# EasyEDA Pro project SSRC v2.eprj

# Schematic Schematic1
Board Name: PCB2; Create Date: 2025-12-02; Page Name: P1; Project Name: SSRC v2; Schematic Name: Schematic1; Update Date: 2025-12-25; Company: EasyEDA.com; Page Size: A4; Version: V1.0
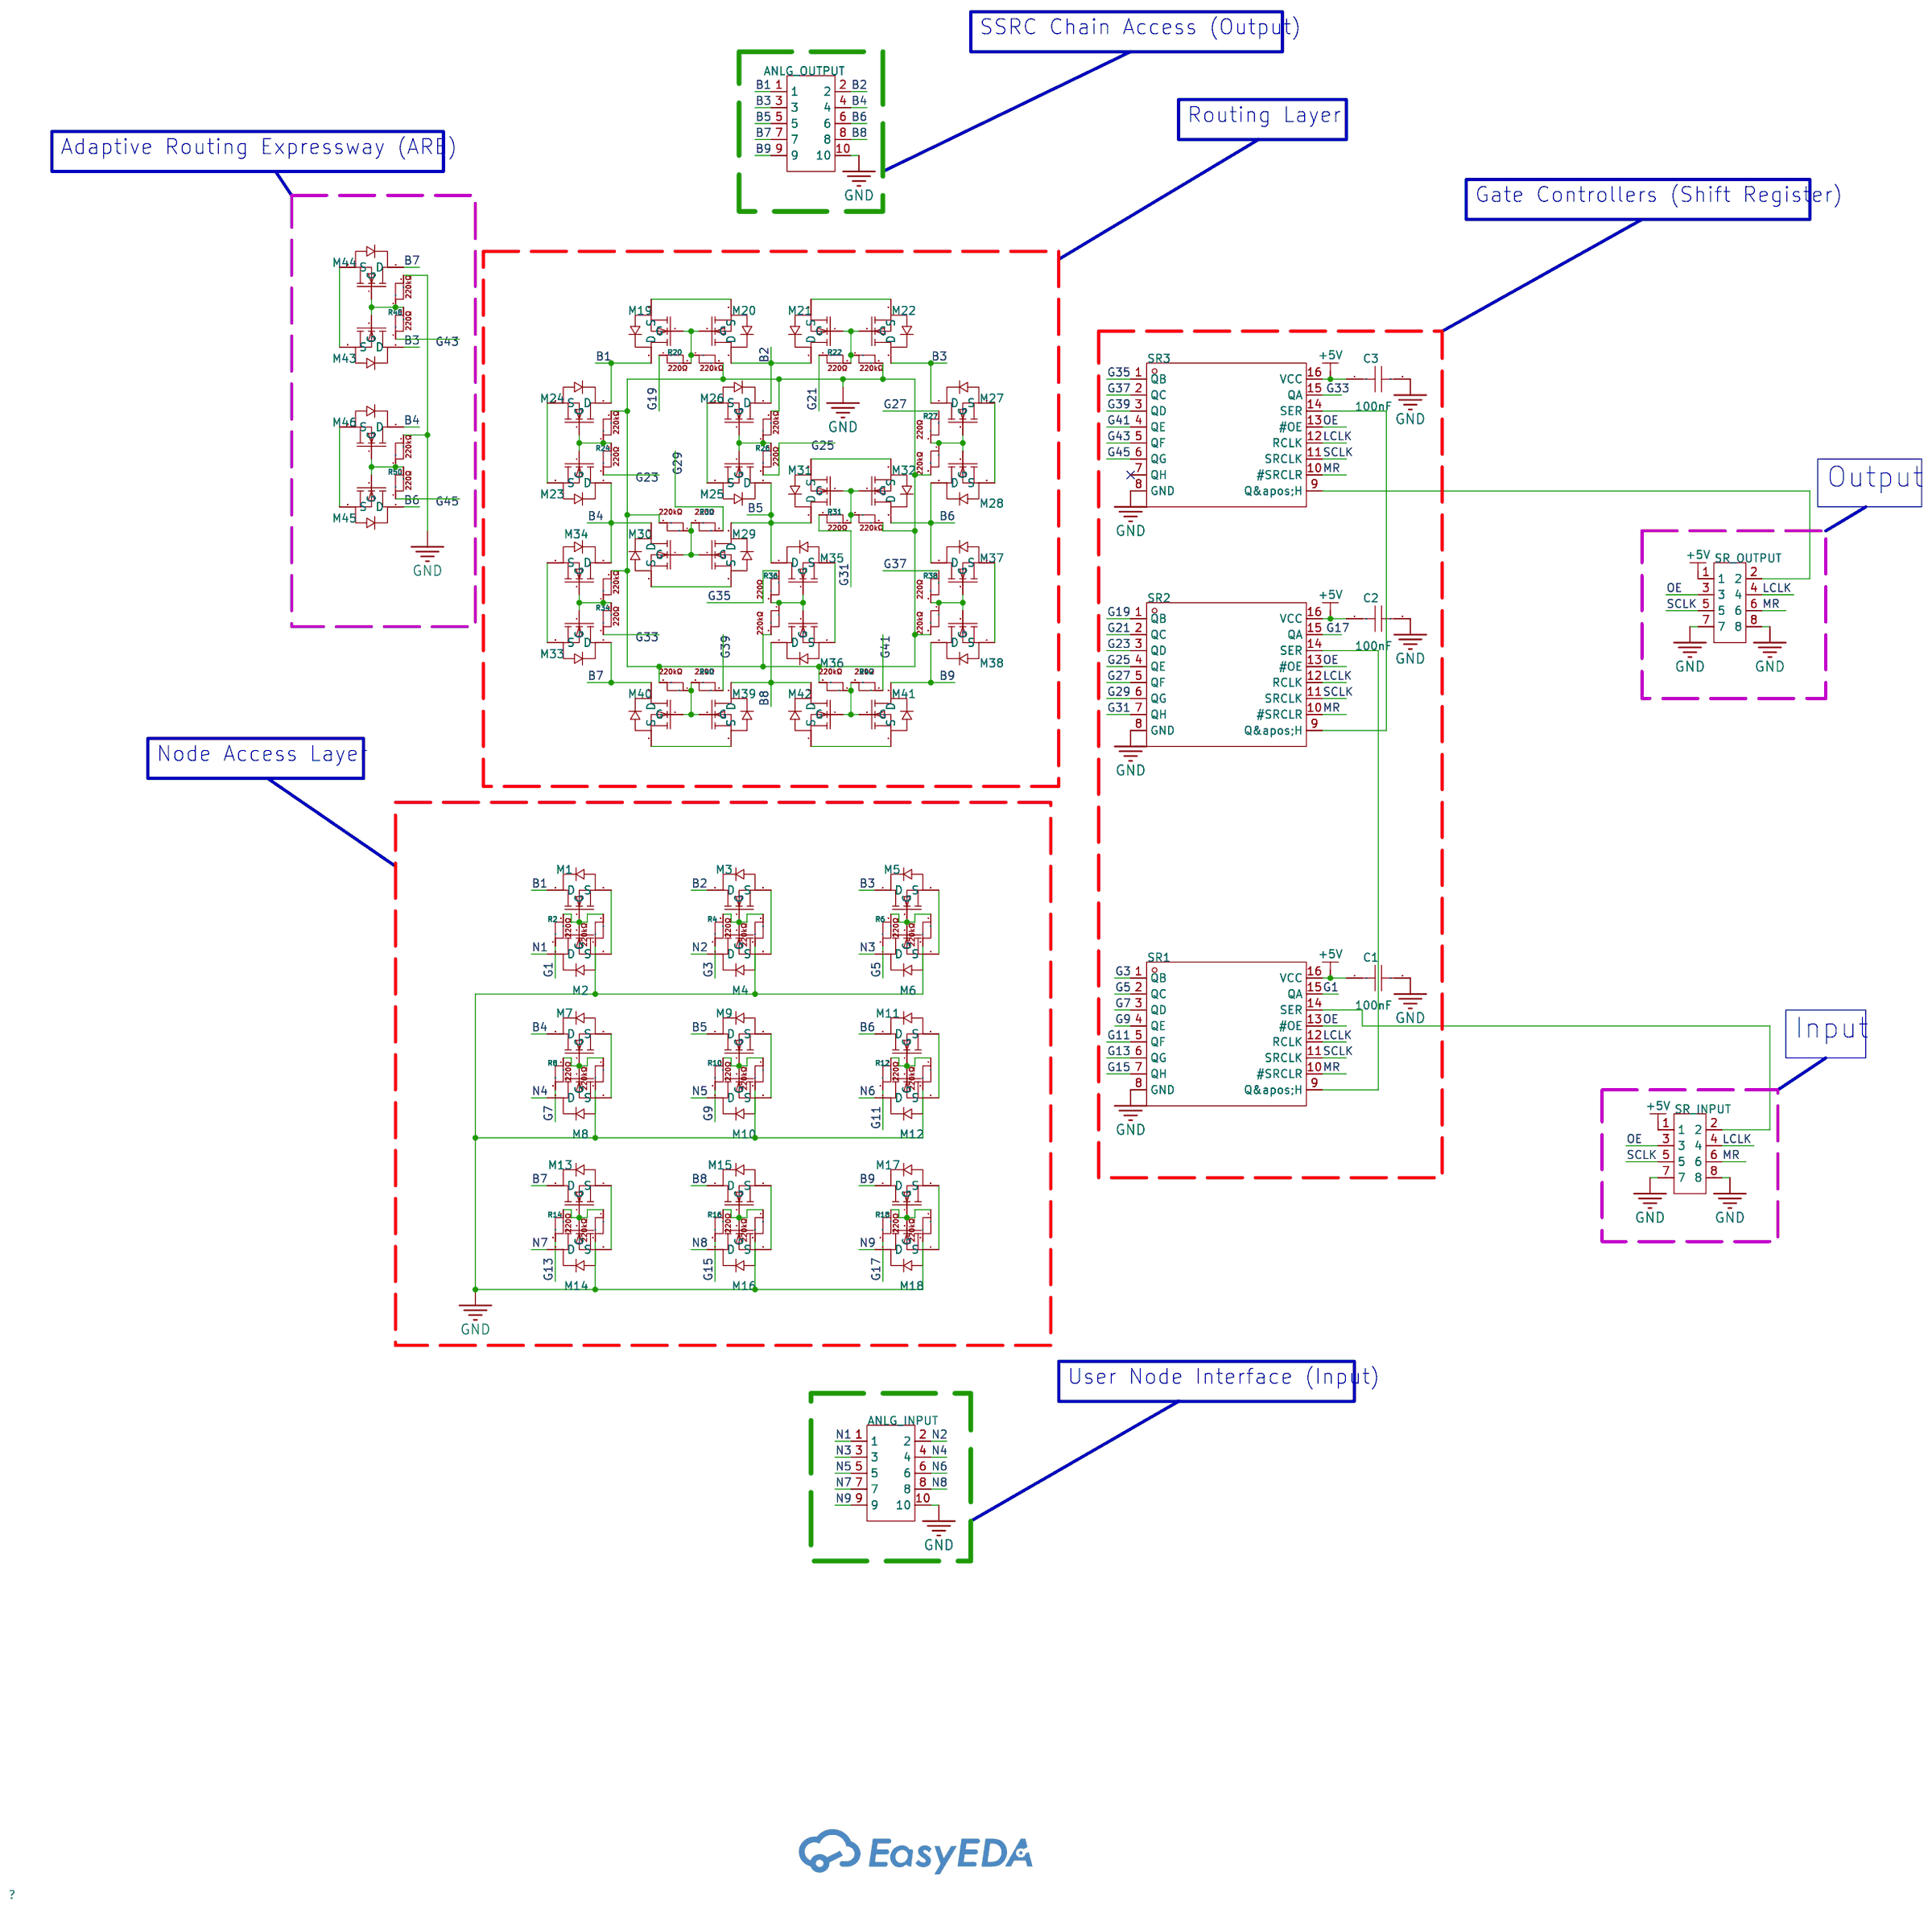
[diagram p0: schematic sheet]

## Parts
ANLG_INPUT  PZ254V-12-10P  [HDR-TH_10P-P2.54-V-M-R2-C5-S2.54]
ANLG_OUTPUT  PZ254V-12-10P  [HDR-TH_10P-P2.54-V-M-R2-C5-S2.54]
C1  100nF  [C0402]
C2  100nF  [C0402]
C3  100nF  [C0402]
M1  -  [SOT-23-3_L2.9-W1.3-P1.90-LS2.4-BR]
M2  -  [SOT-23-3_L2.9-W1.3-P1.90-LS2.4-BR]
M3  -  [SOT-23-3_L2.9-W1.3-P1.90-LS2.4-BR]
M4  -  [SOT-23-3_L2.9-W1.3-P1.90-LS2.4-BR]
M5  -  [SOT-23-3_L2.9-W1.3-P1.90-LS2.4-BR]
M6  -  [SOT-23-3_L2.9-W1.3-P1.90-LS2.4-BR]
M7  -  [SOT-23-3_L2.9-W1.3-P1.90-LS2.4-BR]
M8  -  [SOT-23-3_L2.9-W1.3-P1.90-LS2.4-BR]
M9  -  [SOT-23-3_L2.9-W1.3-P1.90-LS2.4-BR]
M10  -  [SOT-23-3_L2.9-W1.3-P1.90-LS2.4-BR]
M11  -  [SOT-23-3_L2.9-W1.3-P1.90-LS2.4-BR]
M12  -  [SOT-23-3_L2.9-W1.3-P1.90-LS2.4-BR]
M13  -  [SOT-23-3_L2.9-W1.3-P1.90-LS2.4-BR]
M14  -  [SOT-23-3_L2.9-W1.3-P1.90-LS2.4-BR]
M15  -  [SOT-23-3_L2.9-W1.3-P1.90-LS2.4-BR]
M16  -  [SOT-23-3_L2.9-W1.3-P1.90-LS2.4-BR]
M17  -  [SOT-23-3_L2.9-W1.3-P1.90-LS2.4-BR]
M18  -  [SOT-23-3_L2.9-W1.3-P1.90-LS2.4-BR]
M19  -  [SOT-23-3_L2.9-W1.3-P1.90-LS2.4-BR]
M20  -  [SOT-23-3_L2.9-W1.3-P1.90-LS2.4-BR]
M21  -  [SOT-23-3_L2.9-W1.3-P1.90-LS2.4-BR]
M22  -  [SOT-23-3_L2.9-W1.3-P1.90-LS2.4-BR]
M23  -  [SOT-23-3_L2.9-W1.3-P1.90-LS2.4-BR]
M24  -  [SOT-23-3_L2.9-W1.3-P1.90-LS2.4-BR]
M25  -  [SOT-23-3_L2.9-W1.3-P1.90-LS2.4-BR]
M26  -  [SOT-23-3_L2.9-W1.3-P1.90-LS2.4-BR]
M27  -  [SOT-23-3_L2.9-W1.3-P1.90-LS2.4-BR]
M28  -  [SOT-23-3_L2.9-W1.3-P1.90-LS2.4-BR]
M29  -  [SOT-23-3_L2.9-W1.3-P1.90-LS2.4-BR]
M30  -  [SOT-23-3_L2.9-W1.3-P1.90-LS2.4-BR]
M31  -  [SOT-23-3_L2.9-W1.3-P1.90-LS2.4-BR]
M32  -  [SOT-23-3_L2.9-W1.3-P1.90-LS2.4-BR]
M33  -  [SOT-23-3_L2.9-W1.3-P1.90-LS2.4-BR]
M34  -  [SOT-23-3_L2.9-W1.3-P1.90-LS2.4-BR]
M35  -  [SOT-23-3_L2.9-W1.3-P1.90-LS2.4-BR]
M36  -  [SOT-23-3_L2.9-W1.3-P1.90-LS2.4-BR]
M37  -  [SOT-23-3_L2.9-W1.3-P1.90-LS2.4-BR]
M38  -  [SOT-23-3_L2.9-W1.3-P1.90-LS2.4-BR]
M39  -  [SOT-23-3_L2.9-W1.3-P1.90-LS2.4-BR]
M40  -  [SOT-23-3_L2.9-W1.3-P1.90-LS2.4-BR]
M41  -  [SOT-23-3_L2.9-W1.3-P1.90-LS2.4-BR]
M42  -  [SOT-23-3_L2.9-W1.3-P1.90-LS2.4-BR]
M43  -  [SOT-23-3_L2.9-W1.3-P1.90-LS2.4-BR]
M44  -  [SOT-23-3_L2.9-W1.3-P1.90-LS2.4-BR]
M45  -  [SOT-23-3_L2.9-W1.3-P1.90-LS2.4-BR]
M46  -  [SOT-23-3_L2.9-W1.3-P1.90-LS2.4-BR]
R1  -  [R1206-220k]
R2  -  [R1206-220]
R3  -  [R1206-220k]
R4  -  [R1206-220]
R5  -  [R1206-220k]
R6  -  [R1206-220]
R7  -  [R1206-220k]
R8  -  [R1206-220]
R9  -  [R1206-220k]
R10  -  [R1206-220]
R11  -  [R1206-220k]
R12  -  [R1206-220]
R13  -  [R1206-220k]
R14  -  [R1206-220]
R15  -  [R1206-220k]
R16  -  [R1206-220]
R17  -  [R1206-220k]
R18  -  [R1206-220]
R19  -  [R1206-220k]
R20  -  [R1206-220]
R21  -  [R1206-220k]
R22  -  [R1206-220]
R23  -  [R1206-220k]
R24  -  [R1206-220]
R25  -  [R1206-220k]
R26  -  [R1206-220]
R27  -  [R1206-220]
R28  -  [R1206-220k]
R29  -  [R1206-220k]
R30  -  [R1206-220]
R31  -  [R1206-220]
R32  -  [R1206-220k]
R33  -  [R1206-220k]
R34  -  [R1206-220]
R35  -  [R1206-220k]
R36  -  [R1206-220]
R37  -  [R1206-220k]
R38  -  [R1206-220]
R39  -  [R1206-220k]
R40  -  [R1206-220]
R41  -  [R1206-220k]
R42  -  [R1206-220]
R47  -  [R1206-220k]
R48  -  [R1206-220]
R49  -  [R1206-220k]
R50  -  [R1206-220]
SR1  SN74HC595NSR  [SOP-16_L10.3-W5.4-P1.27-LS7.8-BL]
SR2  SN74HC595NSR  [SOP-16_L10.3-W5.4-P1.27-LS7.8-BL]
SR3  SN74HC595NSR  [SOP-16_L10.3-W5.4-P1.27-LS7.8-BL]
SR_INPUT  PZ254V-12-8P  [HDR-TH_8P-P2.54-V-M-R2-C4-S2.54]
SR_OUTPUT  PZ254V-12-8P  [HDR-TH_8P-P2.54-V-M-R2-C4-S2.54]

## Library data of the parts
ANLG_INPUT ANLG_OUTPUT = PZ254V-12-10P: LCSC Part Name: 2x5P 间距:2.54mm 方针 直插; Supplier Part: C492422; Manufacturer: XFCN(兴飞); Supplier Footprint: 插件,P=2.54mm; JLCPCB Part Class: Extended Part; Datasheet: https://item.szlcsc.com/datasheet/PZ254V-12-10P/502978.html; Supplier: LCSC; Pin Structure: 2x5P; Pitch: 2.54mm; Row Spacing: 2.54mm; Circluar Pins/Square Pins: Pin Header; Mounting Type: Through Hole; Number of Rows: 2; Number of Pins: 10P; Length of Mating Pin: 6mm; Insulation Height: 2.5mm; Length of End Connection Pin: 3mm; Contact Material: Brass; Operating Temperature: -40℃~+105℃; Color: Black
C1-C3 = CC0805KRX7R9BB104: LCSC Part Name: 100nF ±10% 50V; Supplier Part: C49678; Manufacturer: YAGEO(国巨); Supplier Footprint: 0805; JLCPCB Part Class: Basic Part; Datasheet: https://item.szlcsc.com/datasheet/CC0805KRX7R9BB104/50686.html; Supplier: LCSC; Tolerance: ±10%; Voltage Rating: 50V; Temperature Coefficient: X7R
M1-M46 = AO3400A_N: Supplier Footprint: SOT-23; Supplier Part: C700953; Type: 1个NChannel; Drain Source On Resistance (RDS(on)@Vgs,Id): 35mΩ@10V,5A; Gate Threshold Voltage (Vgs(th)@Id): 1.5V@250uA
R1 R3 R5 R7 R9 R11 R13 R15 R17 R19 R21 R23 R25 R28 R29 R32 R33 R35 R37 R39 R41 R47 R49 = RC1206FR-07220KL
R2 R4 R6 R8 R10 R12 R14 R16 R18 R20 R22 R24 R26 R27 R30 R31 R34 R36 R38 R40 R42 R48 R50 = RC1206FR-10220RL (mini schem)
SR1-SR3 = SN74HC595NSR: LCSC Part Name: 三态输出 8位串行至串行或并行移位寄存器; Supplier Part: C191873; Manufacturer: TI(德州仪器); Supplier Footprint: SOP-16-208mil; JLCPCB Part Class: Extended Part; Datasheet: https://www.ti.com/cn/lit/gpn/sn74hc595; Supplier: LCSC; Function: Serial-to-Serial or Parallel; Voltage - Supply: 2V~6V; Clock Frequency: 29MHz; Number of Bits per Element: 8; Output Type: Tri-State; Series: 74HC; Operating Temperature: -40℃~+85℃; Propagation Delay: 27ns@6V,50pF; Output Current: 6mA
SR_INPUT SR_OUTPUT = PZ254V-12-8P: LCSC Part Name: 2x4P 间距:2.54mm 方针 直插; Supplier Part: C492421; Manufacturer: XFCN(兴飞); Supplier Footprint: 插件,P=2.54mm; JLCPCB Part Class: Extended Part; Datasheet: https://item.szlcsc.com/datasheet/PZ254V-12-8P/502977.html; Supplier: LCSC; Pin Structure: 2x4P; Pitch: 2.54mm; Row Spacing: 2.54mm; Circluar Pins/Square Pins: Pin Header; Mounting Type: Through Hole; Number of Rows: 2; Number of Pins: 8P; Length of Mating Pin: 6mm; Insulation Height: 2.5mm; Length of End Connection Pin: 3mm; Contact Material: Brass; Operating Temperature: -40℃~+105℃; Color: Black

## Nets
+5V: C1.1 C2.1 C3.1 SR1.16(VCC) SR2.16(VCC) SR3.16(VCC) SR_INPUT.1 SR_OUTPUT.1
GND: ANLG_INPUT.10 ANLG_OUTPUT.10 C1.2 C2.2 C3.2 R1.2(1) R3.2(1) R5.2(1) R7.2(1) R9.2(1) R11.2(1) R13.2(1) R15.2(1) R17.2(1) R19.2(1) R21.2(1) R23.2(1) R25.2(1) R28.2(1) R29.2(1) R32.2(1) R33.2(1) R35.2(1) R37.2(1) R39.2(1) R41.2(1) R47.2(1) R49.2(1) SR1.8(GND) SR2.8(GND) SR3.8(GND) SR_INPUT.7 SR_INPUT.8 SR_OUTPUT.7 SR_OUTPUT.8
B1: ANLG_OUTPUT.1 M1.3(D) M19.3(D) M24.3(D)
B2: ANLG_OUTPUT.2 M3.3(D) M20.3(D) M21.3(D) M26.3(D)
B3: ANLG_OUTPUT.3 M5.3(D) M22.3(D) M27.3(D) M43.3(D)
B4: ANLG_OUTPUT.4 M7.3(D) M23.3(D) M30.3(D) M34.3(D) M46.3(D)
B5: ANLG_OUTPUT.5 M9.3(D) M25.3(D) M29.3(D) M31.3(D) M35.3(D)
B6: ANLG_OUTPUT.6 M11.3(D) M28.3(D) M32.3(D) M37.3(D) M45.3(D)
B7: ANLG_OUTPUT.7 M13.3(D) M33.3(D) M40.3(D) M44.3(D)
B8: ANLG_OUTPUT.8 M15.3(D) M36.3(D) M39.3(D) M42.3(D)
B9: ANLG_OUTPUT.9 M17.3(D) M38.3(D) M41.3(D)
G1: R2.1 SR1.15(QA)
G3: R4.1 SR1.1(QB)
G5: R6.1 SR1.2(QC)
G7: R8.1 SR1.3(QD)
G9: R10.1 SR1.4(QE)
G11: R12.1 SR1.5(QF)
G13: R14.1 SR1.6(QG)
G15: R16.1 SR1.7(QH)
G17: R18.1 SR2.15(QA)
G19: R20.1 SR2.1(QB)
G21: R22.1 SR2.2(QC)
G23: R24.1 SR2.3(QD)
G25: R26.1 SR2.4(QE)
G27: R27.1 SR2.5(QF)
G29: R30.1 SR2.6(QG)
G31: R31.1 SR2.7(QH)
G33: R34.1 SR3.15(QA)
G35: R36.1 SR3.1(QB)
G37: R38.1 SR3.2(QC)
G39: R40.1 SR3.3(QD)
G41: R42.1 SR3.4(QE)
G43: R48.1 SR3.5(QF)
G45: R50.1 SR3.6(QG)
LCLK: SR1.12(RCLK) SR2.12(RCLK) SR3.12(RCLK) SR_INPUT.4 SR_OUTPUT.4
MR: SR1.10(#SRCLR) SR2.10(#SRCLR) SR3.10(#SRCLR) SR_INPUT.6 SR_OUTPUT.6
N1: ANLG_INPUT.1 M2.3(D)
N2: ANLG_INPUT.2 M4.3(D)
N3: ANLG_INPUT.3 M6.3(D)
N4: ANLG_INPUT.4 M8.3(D)
N5: ANLG_INPUT.5 M10.3(D)
N6: ANLG_INPUT.6 M12.3(D)
N7: ANLG_INPUT.7 M14.3(D)
N8: ANLG_INPUT.8 M16.3(D)
N9: ANLG_INPUT.9 M18.3(D)
OE: SR1.13(#OE) SR2.13(#OE) SR3.13(#OE) SR_INPUT.3 SR_OUTPUT.3
SCLK: SR1.11(SRCLK) SR2.11(SRCLK) SR3.11(SRCLK) SR_INPUT.5 SR_OUTPUT.5
$1N32987: SR1.9(Q&apos;H) SR2.14(SER)
$1N32993: SR2.9(Q&apos;H) SR3.14(SER)
$1N34192: SR1.14(SER) SR_INPUT.2
$1N34221: SR3.9(Q&apos;H) SR_OUTPUT.2
$1N43712: M1.1(G) M2.1(G) R1.1 R2.2(1)
$1N43716: M1.2(S) M2.2(S)
$1N43718: M3.1(G) M4.1(G) R3.1 R4.2(1)
$1N43720: M5.1(G) M6.1(G) R5.1 R6.2(1)
$1N43729: M11.1(G) M12.1(G) R11.1 R12.2(1)
$1N43733: M9.1(G) M10.1(G) R9.1 R10.2(1)
$1N43737: M7.1(G) M8.1(G) R7.1 R8.2(1)
$1N43739: M13.1(G) M14.1(G) R13.1 R14.2(1)
$1N43741: M15.1(G) M16.1(G) R15.1 R16.2(1)
$1N43743: M17.1(G) M18.1(G) R17.1 R18.2(1)
$1N43747: M3.2(S) M4.2(S)
$1N43751: M5.2(S) M6.2(S)
$1N43756: M7.2(S) M8.2(S)
$1N43761: M9.2(S) M10.2(S)
$1N43766: M11.2(S) M12.2(S)
$1N43771: M13.2(S) M14.2(S)
$1N43776: M15.2(S) M16.2(S)
$1N43781: M17.2(S) M18.2(S)
$1N44525: M29.1(G) M30.1(G) R29.1 R30.2(1)
$1N44529: M29.2(S) M30.2(S)
$1N44667: M25.1(G) M26.1(G) R25.1 R26.2(1)
$1N44669: M25.2(S) M26.2(S)
$1N44737: M31.1(G) M32.1(G) R31.2(1) R32.1
$1N44739: M31.2(S) M32.2(S)
$1N44807: M35.1(G) M36.1(G) R35.1 R36.2(1)
$1N44809: M35.2(S) M36.2(S)
$1N45023: M21.1(G) M22.1(G) R21.1 R22.2(1)
$1N45025: M21.2(S) M22.2(S)
$1N45166: M19.1(G) M20.1(G) R19.1 R20.2(1)
$1N45168: M19.2(S) M20.2(S)
$1N45236: M23.1(G) M24.1(G) R23.1 R24.2(1)
$1N45238: M23.2(S) M24.2(S)
$1N45306: M33.1(G) M34.1(G) R33.1 R34.2(1)
$1N45308: M33.2(S) M34.2(S)
$1N45376: M39.1(G) M40.1(G) R39.1 R40.2(1)
$1N45378: M39.2(S) M40.2(S)
$1N45446: M41.1(G) M42.1(G) R41.1 R42.2(1)
$1N45448: M41.2(S) M42.2(S)
$1N45516: M37.1(G) M38.1(G) R37.1 R38.2(1)
$1N45518: M37.2(S) M38.2(S)
$1N45586: M27.1(G) M28.1(G) R27.2(1) R28.1
$1N45588: M27.2(S) M28.2(S)
$1N47159: M43.1(G) M44.1(G) R47.1 R48.2(1)
$1N47164: M43.2(S) M44.2(S)
$1N47285: M45.1(G) M46.1(G) R49.1 R50.2(1)
$1N47290: M45.2(S) M46.2(S)

Not connected (* = marked no-connect by the designer): SR3 7(QH)*

## Notes on the sheet
- SSRC Chain Access (Output)
- Routing Layer
- Adaptive Routing Expressway (ARE)
- Gate Controllers (Shift Register)
- Output
- Node Access Layer
- Input
- User Node Interface (Input)

# Board PCB1
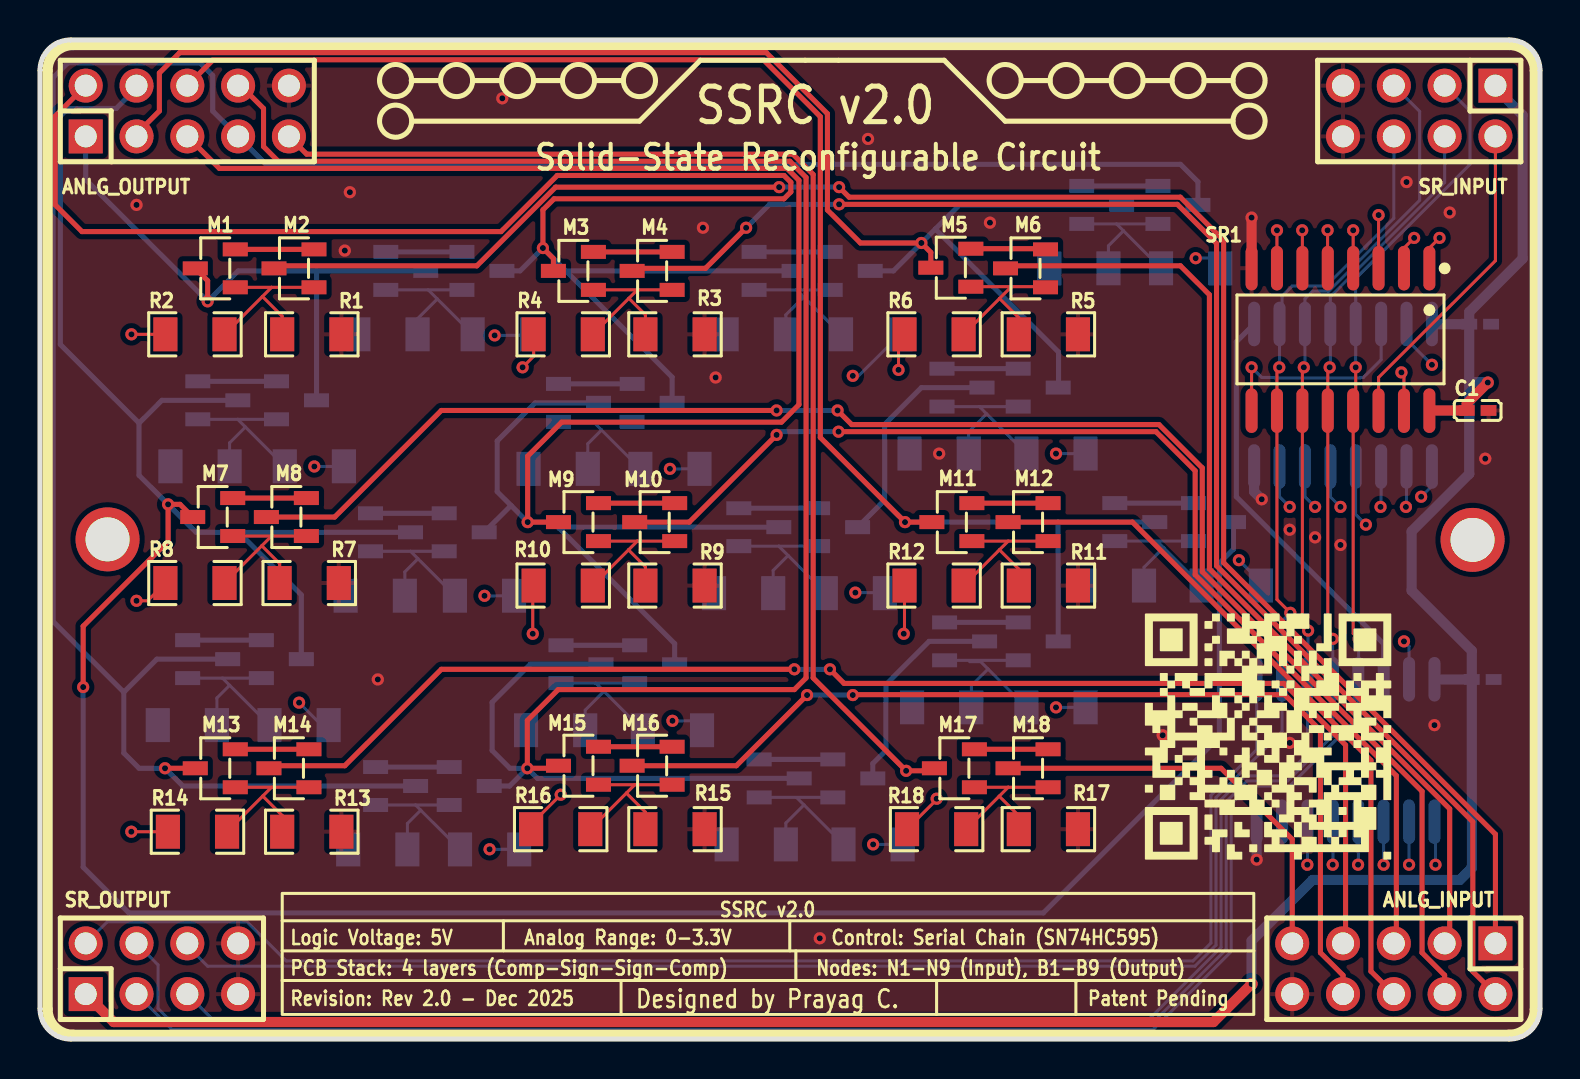
[diagram p1: board, top side]
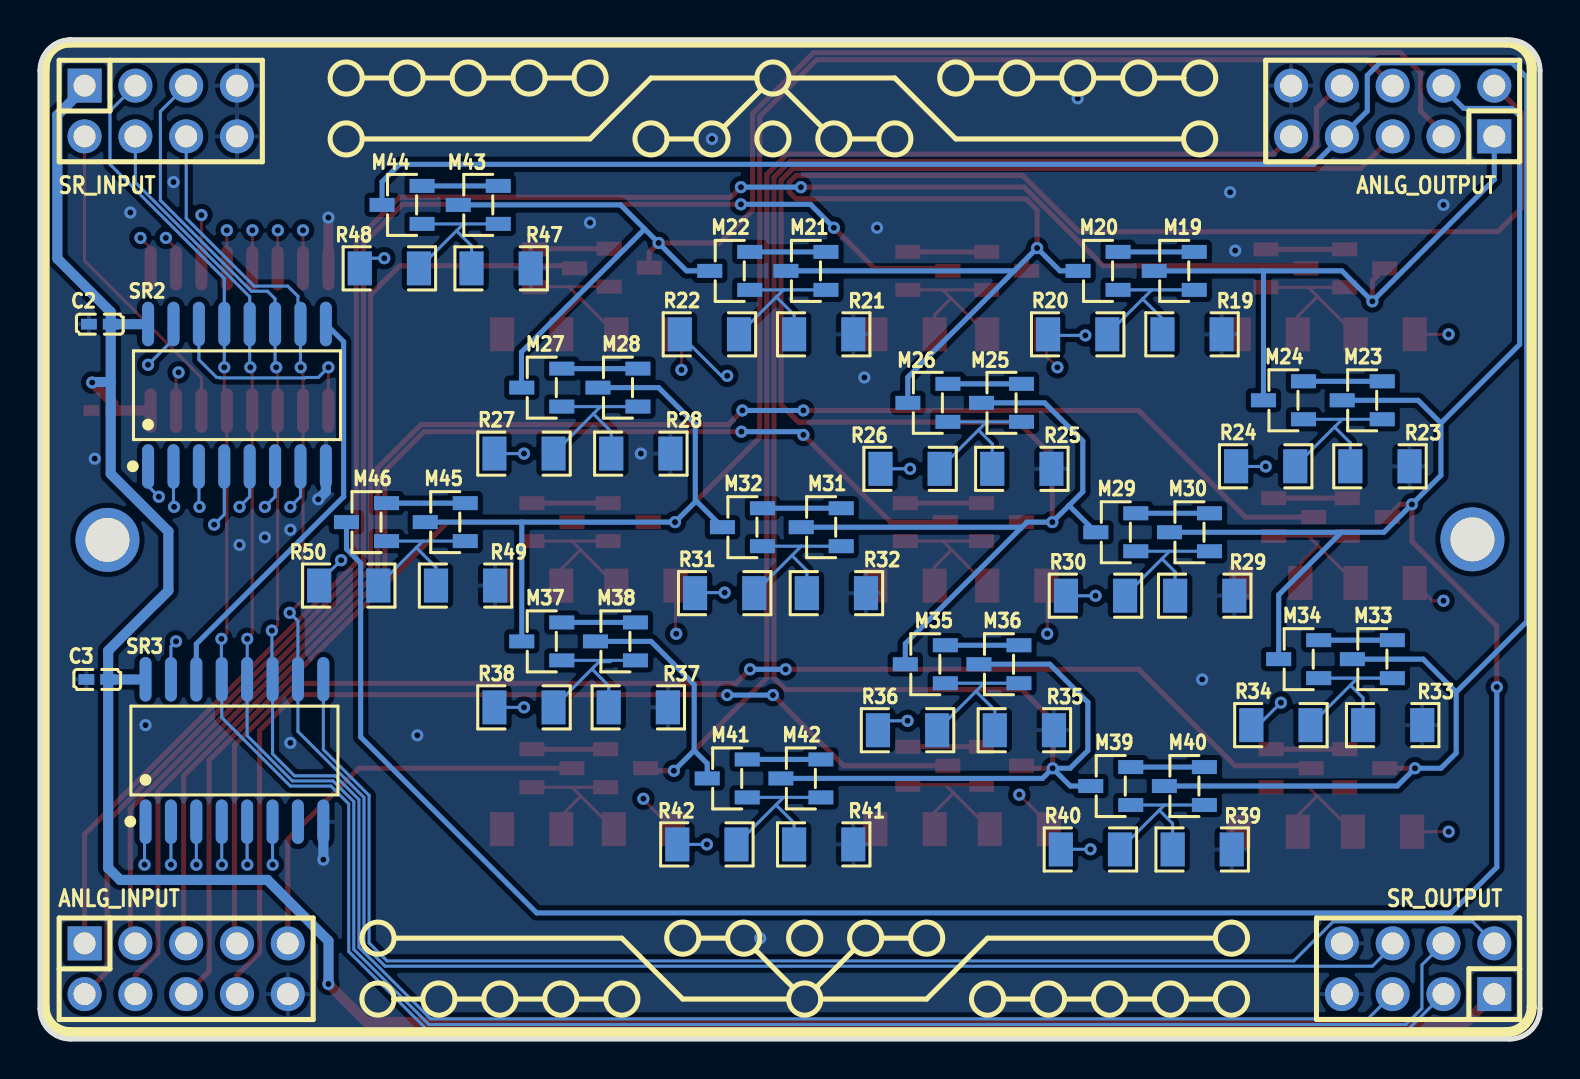
[diagram p2: board, bottom side, seen from below]

Outline 75 x 50 mm; copper layers: Top Layer, Inner1, Inner2, Bottom Layer. Coordinates in mm from the lower left corner of the outline.
Outline path: 0,48.48 0,1.52 arc(0.45,0.45) 1.52,0 73.48,0 arc(74.55,0.45) 75,1.52 75,48.48 arc(74.55,49.55) 73.48,50 1.52,50 arc(0.45,49.55) 0,48.48
Stack: Top Layer 0.035mm Outer layer thickness 1oz / Dielectric1 0.2104mm 7628 RC49% 8.6mil / Inner1 0.0152mm Inner layer thickness / Dielectric2 1.065mm 1.1mm H/HOZ Copper / Inner2 0.0152mm Inner layer thickness / Dielectric3 0.2104mm 7628 RC49% 8.6mil / Bottom Layer 0.035mm Outer layer thickness 1oz

## Design rules (mm)
template: JLCPCB Capability(Two Layers Board)
spacing copperThickness1oz (default): track to track 0.102, other pairs 0.152 to 0.3
spacing copperThickness2oz: track to track 0.203, other pairs 0.152 to 0.3
track width copperThickness1oz (default): min 0.127, default 0.254, max 2.54
track width copperThickness2oz: min 0.203, default 0.254, max 2.54
differential pair differentialPair (default): width min 0.127, default 0.254, max 2.54; gap min 0.152, default 0.152
via viaSize (default): diameter min 0.5, default 0.61, max 10; hole min 0.3, default 0.305, max 6.3

## Placement (name value [footprint] x y rotation side)
ANLG_INPUT  PZ254V-12-10P  [HDR-TH_10P-P2.54-V-M-R2-C5-S2.54]  67.69 3.52 180 top
ANLG_OUTPUT  PZ254V-12-10P  [HDR-TH_10P-P2.54-V-M-R2-C5-S2.54]  7.37 46.44 0 top
C1  100nF  [C0402]  71.88 31.46 0 top
C2  100nF  [C0402]  72.01 35.78 0 bottom
C3  100nF  [C0402]  72.14 18 0 bottom
M1  -  [SOT-23-3_L2.9-W1.3-P1.90-LS2.4-BR]  8.76 38.57 0 top
M2  -  [SOT-23-3_L2.9-W1.3-P1.90-LS2.4-BR]  12.7 38.57 0 top
M3  -  [SOT-23-3_L2.9-W1.3-P1.90-LS2.4-BR]  26.67 38.44 0 top
M4  -  [SOT-23-3_L2.9-W1.3-P1.90-LS2.4-BR]  30.61 38.44 0 top
M5  -  [SOT-23-3_L2.9-W1.3-P1.90-LS2.4-BR]  45.54 38.6 0 top
M6  -  [SOT-23-3_L2.9-W1.3-P1.90-LS2.4-BR]  49.28 38.57 0 top
M7  -  [SOT-23-3_L2.9-W1.3-P1.90-LS2.4-BR]  8.64 26.12 0 top
M8  -  [SOT-23-3_L2.9-W1.3-P1.90-LS2.4-BR]  12.32 26.12 0 top
M9  -  [SOT-23-3_L2.9-W1.3-P1.90-LS2.4-BR]  26.92 25.87 0 top
M10  -  [SOT-23-3_L2.9-W1.3-P1.90-LS2.4-BR]  30.73 25.87 0 top
M11  -  [SOT-23-3_L2.9-W1.3-P1.90-LS2.4-BR]  45.59 25.87 0 top
M12  -  [SOT-23-3_L2.9-W1.3-P1.90-LS2.4-BR]  49.4 25.87 0 top
M13  -  [SOT-23-3_L2.9-W1.3-P1.90-LS2.4-BR]  8.76 13.55 0 top
M14  -  [SOT-23-3_L2.9-W1.3-P1.90-LS2.4-BR]  12.45 13.55 0 top
M15  -  [SOT-23-3_L2.9-W1.3-P1.90-LS2.4-BR]  26.92 13.68 0 top
M16  -  [SOT-23-3_L2.9-W1.3-P1.90-LS2.4-BR]  30.61 13.68 0 top
M17  -  [SOT-23-3_L2.9-W1.3-P1.90-LS2.4-BR]  45.72 13.55 0 top
M18  -  [SOT-23-3_L2.9-W1.3-P1.90-LS2.4-BR]  49.4 13.55 0 top
M19  -  [SOT-23-3_L2.9-W1.3-P1.90-LS2.4-BR]  18.29 38.44 180 bottom
M20  -  [SOT-23-3_L2.9-W1.3-P1.90-LS2.4-BR]  22.1 38.44 180 bottom
M21  -  [SOT-23-3_L2.9-W1.3-P1.90-LS2.4-BR]  36.7 38.44 180 bottom
M22  -  [SOT-23-3_L2.9-W1.3-P1.90-LS2.4-BR]  40.51 38.44 180 bottom
M23  -  [SOT-23-3_L2.9-W1.3-P1.90-LS2.4-BR]  8.89 31.97 180 bottom
M24  -  [SOT-23-3_L2.9-W1.3-P1.90-LS2.4-BR]  12.83 31.97 180 bottom
M25  -  [SOT-23-3_L2.9-W1.3-P1.90-LS2.4-BR]  26.92 31.84 180 bottom
M26  -  [SOT-23-3_L2.9-W1.3-P1.90-LS2.4-BR]  30.61 31.84 180 bottom
M27  -  [SOT-23-3_L2.9-W1.3-P1.90-LS2.4-BR]  49.91 32.6 180 bottom
M28  -  [SOT-23-3_L2.9-W1.3-P1.90-LS2.4-BR]  46.1 32.6 180 bottom
M29  -  [SOT-23-3_L2.9-W1.3-P1.90-LS2.4-BR]  21.21 25.36 180 bottom
M30  -  [SOT-23-3_L2.9-W1.3-P1.90-LS2.4-BR]  17.53 25.36 180 bottom
M31  -  [SOT-23-3_L2.9-W1.3-P1.90-LS2.4-BR]  35.94 25.62 180 bottom
M32  -  [SOT-23-3_L2.9-W1.3-P1.90-LS2.4-BR]  39.88 25.62 180 bottom
M33  -  [SOT-23-3_L2.9-W1.3-P1.90-LS2.4-BR]  8.38 19.01 180 bottom
M34  -  [SOT-23-3_L2.9-W1.3-P1.90-LS2.4-BR]  12.06 19.01 180 bottom
M35  -  [SOT-23-3_L2.9-W1.3-P1.90-LS2.4-BR]  30.73 18.76 180 bottom
M36  -  [SOT-23-3_L2.9-W1.3-P1.90-LS2.4-BR]  27.05 18.76 180 bottom
M37  -  [SOT-23-3_L2.9-W1.3-P1.90-LS2.4-BR]  49.91 19.9 180 bottom
M38  -  [SOT-23-3_L2.9-W1.3-P1.90-LS2.4-BR]  46.23 19.9 180 bottom
M39  -  [SOT-23-3_L2.9-W1.3-P1.90-LS2.4-BR]  21.46 12.66 180 bottom
M40  -  [SOT-23-3_L2.9-W1.3-P1.90-LS2.4-BR]  17.78 12.66 180 bottom
M41  -  [SOT-23-3_L2.9-W1.3-P1.90-LS2.4-BR]  40.64 13.04 180 bottom
M42  -  [SOT-23-3_L2.9-W1.3-P1.90-LS2.4-BR]  36.96 13.04 180 bottom
M43  -  [SOT-23-3_L2.9-W1.3-P1.90-LS2.4-BR]  53.09 41.74 180 bottom
M44  -  [SOT-23-3_L2.9-W1.3-P1.90-LS2.4-BR]  56.9 41.74 180 bottom
M45  -  [SOT-23-3_L2.9-W1.3-P1.90-LS2.4-BR]  54.74 25.87 180 bottom
M46  -  [SOT-23-3_L2.9-W1.3-P1.90-LS2.4-BR]  58.67 25.87 180 bottom
NOREF  -  [Pad_e2095]  3.38 25.01 0 top
NOREF#2  -  [Pad_e1924]  71.63 24.98 0 top
R1  -  [R1206-220k]  13.59 35.27 0 top
R2  -  [R1206-220]  7.75 35.27 0 top
R3  -  [R1206-220k]  31.75 35.27 0 top
R4  -  [R1206-220]  26.16 35.27 0 top
R5  -  [R1206-220k]  50.42 35.27 0 top
R6  -  [R1206-220]  44.7 35.27 0 top
R7  -  [R1206-220k]  13.46 22.82 0 top
R8  -  [R1206-220]  7.75 22.82 0 top
R9  -  [R1206-220k]  31.75 22.69 0 top
R10  -  [R1206-220]  26.16 22.69 0 top
R11  -  [R1206-220k]  50.42 22.69 0 top
R12  -  [R1206-220]  44.7 22.69 0 top
R13  -  [R1206-220k]  13.59 10.38 0 top
R14  -  [R1206-220]  7.87 10.38 0 top
R15  -  [R1206-220k]  31.75 10.5 0 top
R16  -  [R1206-220]  26.03 10.5 0 top
R17  -  [R1206-220k]  50.42 10.5 0 top
R18  -  [R1206-220]  44.83 10.5 0 top
R19  -  [R1206-220k]  17.4 35.27 180 bottom
R20  -  [R1206-220]  23.11 35.27 180 bottom
R21  -  [R1206-220k]  35.81 35.27 180 bottom
R22  -  [R1206-220]  41.53 35.27 180 bottom
R23  -  [R1206-220k]  8 28.66 180 bottom
R24  -  [R1206-220]  13.72 28.66 180 bottom
R25  -  [R1206-220k]  25.91 28.54 180 bottom
R26  -  [R1206-220]  31.5 28.54 180 bottom
R27  -  [R1206-220]  50.8 29.3 180 bottom
R28  -  [R1206-220k]  44.96 29.3 180 bottom
R29  -  [R1206-220k]  16.76 22.19 180 bottom
R30  -  [R1206-220]  22.22 22.19 180 bottom
R31  -  [R1206-220]  40.77 22.31 180 bottom
R32  -  [R1206-220k]  35.18 22.31 180 bottom
R33  -  [R1206-220k]  7.37 15.71 180 bottom
R34  -  [R1206-220]  12.95 15.71 180 bottom
R35  -  [R1206-220k]  25.78 15.46 180 bottom
R36  -  [R1206-220]  31.62 15.46 180 bottom
R37  -  [R1206-220k]  45.09 16.6 180 bottom
R38  -  [R1206-220]  50.8 16.6 180 bottom
R39  -  [R1206-220k]  16.89 9.49 180 bottom
R40  -  [R1206-220]  22.48 9.49 180 bottom
R41  -  [R1206-220k]  35.81 9.74 180 bottom
R42  -  [R1206-220]  41.66 9.74 180 bottom
R47  -  [R1206-220k]  51.94 38.57 180 bottom
R48  -  [R1206-220]  57.53 38.57 180 bottom
R49  -  [R1206-220k]  53.72 22.69 180 bottom
R50  -  [R1206-220]  59.56 22.69 180 bottom
SR1  SN74HC595NSR  [SOP-16_L10.3-W5.4-P1.27-LS7.8-BL]  65.02 35.01 180 top
SR2  SN74HC595NSR  [SOP-16_L10.3-W5.4-P1.27-LS7.8-BL]  65.15 32.22 180 bottom
SR3  SN74HC595NSR  [SOP-16_L10.3-W5.4-P1.27-LS7.8-BL]  65.28 14.44 180 bottom
SR_INPUT  PZ254V-12-8P  [HDR-TH_8P-P2.54-V-M-R2-C4-S2.54]  68.96 46.44 180 top
SR_OUTPUT  PZ254V-12-8P  [HDR-TH_8P-P2.54-V-M-R2-C4-S2.54]  6.1 3.52 0 top

## Footprints (pads in the part's own frame, mm; a bottom-side part is the same pattern mirrored in y, then rotated)
C0402
  rect 0.79x0.54 smd: 1(-0.545,0) 2(0.545,0)
HDR-TH_8P-P2.54-V-M-R2-C4-S2.54
  rect 1.7x1.7 hole 1.1: 1(-3.81,-1.27)
  round 1.7 hole 1.1: 2(-3.81,1.27) 3(-1.27,-1.27) 4(-1.27,1.27) 5(1.27,-1.27) 6(1.27,1.27) 7(3.81,-1.27) 8(3.81,1.27)
HDR-TH_10P-P2.54-V-M-R2-C5-S2.54
  rect 1.7x1.7 hole 1.1: 1(-5.08,-1.27)
  round 1.7 hole 1.1: 2(-5.08,1.27) 3(-2.54,-1.27) 4(-2.54,1.27) 5(0,-1.27) 6(0,1.27) 7(2.54,-1.27) 8(2.54,1.27) 9(5.08,-1.27) 10(5.08,1.27)
Pad_e1924
  round 3.2 hole 2.2: 2(0,0)
Pad_e2095
  round 3.2 hole 2.2: 1(0,0)
R1206-220
  rect 1.208x1.701 smd: 1(-1.479,0) 2(1.479,0)
R1206-220k
  rect 1.208x1.701 smd: 1(-1.479,0) 2(1.479,0)
SOP-16_L10.3-W5.4-P1.27-LS7.8-BL
  oval 0.602x2.231 smd: 1(-4.445,-3.566) 2(-3.175,-3.566) 3(-1.905,-3.566) 4(-0.635,-3.566) 5(0.635,-3.566) 6(1.905,-3.566) 7(3.175,-3.566) 8(4.445,-3.566) 9(4.445,3.566) 10(3.175,3.566) 11(1.905,3.566) 12(0.635,3.566) 13(-0.635,3.566) 14(-1.905,3.566) 15(-3.175,3.566) 16(-4.445,3.566)
SOT-23-3_L2.9-W1.3-P1.90-LS2.4-BR
  rect 1.25x0.7 smd: 1(1,-0.95) 2(1,0.95) 3(-1,0)

## Nets
As in the schematic.

Pads without a net: NOREF 1; NOREF#2 2; SR3 7

## Via types
v1: diameter 0.61, hole 0.305, Top Layer to Bottom Layer, 102 vias

## Routing (per net, layer and track width the routed paths; a pad name or vN(x,y) marks a point on that pad's centre or on a via; arc(x,y) is an arc through that point)
+5V: length 126
  Top Layer w0.508: SR_OUTPUT.1 3.68,0.85 58.67,0.85 v1(60.58,2.76) ; v1(72.39,32.85) 71.34,31.8 C1.1 69.48,31.46 SR1.16
  Bottom Layer w0.508: SR3.16 69.73,18 C3.1 ; SR_INPUT.1 72.77,47.6 74.13,46.24 74.13,39.06 71.46,36.39 C2.1 ; 71.46,32.88 71.46,28.29 68.58,25.4 68.58,22.44 71.59,19.43 C3.1 ; 71.46,32.88 72.37,32.88 v1(72.39,32.85) ; 71.46,32.88 C2.1 ; SR2.16 69.61,35.78 C2.1 ; v1(60.58,2.76) 60.58,4.91 63.63,7.96 70.99,7.96 71.59,8.56 C3.1
GND: length 6.2
  Top Layer w0.508: SR1.8 v1(60.58,41.11)
  Bottom Layer w0.508: SR3.8 v1(60.83,8.98) ; v1(61.09,27.01) 60.71,27.39 SR2.8
  vias: v1(4.83,41.74) v1(15.24,39.46) v1(15.49,42.38) v1(16.89,18) v1(23.11,47.08) v1(33.15,40.6) v1(33.78,33.11) v1(38.99,5.04) v1(41.4,45.05) v1(44.96,29.3) v1(47.5,40.86) v1(56.13,15.2) v1(62.48,25.49) v1(62.48,14.82) v1(63.75,25.11) v1(65.02,24.73) v1(68.33,42.89) v1(69.72,15.71) v1(70.49,41.36) v1(72.26,29.04)
B1: length 30.7
  Top Layer w0.254: v1(8.38,36.92) 8.38,37.95 M1.3
  Bottom Layer w0.254: ANLG_OUTPUT.1 2.29,43.01 v1(8.38,36.92) 9.91,38.44 13.83,38.44 ; M19.3 13.83,38.44 ; 13.83,38.44 M24.3
B2: length 86.1
  Top Layer w0.254: M3.3 25.67,39.06 v1(25.15,39.59) 25.15,41.5 25.7,42.05 37.2,42.05 37.54,42.39 37.54,42.88 37.2,43.22 25.86,43.22 23.05,40.41 2.1,40.41 0.76,41.74 0.76,46.19 ANLG_OUTPUT.2
  Bottom Layer w0.254: M21.3 26.29,38.44 ; 26.29,38.44 31.61,33.12 M26.3 ; 26.29,38.44 v1(25.15,39.59) 24,38.44 M20.3
B3: length 74.8
  Top Layer w0.254: M5.3 44.54,39.37 v1(44.07,39.84) 41.02,39.84 39.37,41.49 39.37,46.31 36.32,49.36 6.98,49.36 5.97,48.35 5.97,46.44 4.83,45.3 ANLG_OUTPUT.3
  Bottom Layer w0.254: 44.77,40.54 50.93,34.38 50.93,32.62 M27.3 ; 44.77,40.54 45.97,41.74 M43.3 ; 44.77,40.54 v1(44.07,39.84) 42.67,38.44 M22.3
B4: length 145.8
  Top Layer w0.254: v1(2.16,17.61) 2.16,20.66 6.41,24.91 v1(6.41,26.76) 7,26.76 M7.3
  Bottom Layer w0.254: v1(2.16,17.61) 2.16,8.6 4.45,6.31 50.16,6.31 58.97,15.11 58.97,23.81 59.67,24.52 M46.3 ; 9.93,25.36 7.8,25.36 v1(6.41,26.76) 4.95,28.21 4.95,30.82 ; 9.93,25.36 M30.3 ; 9.93,25.36 13.06,22.23 M34.3 ; ANLG_OUTPUT.4 4.83,47.59 3.81,46.57 1.4,46.57 1.02,46.19 1.02,34.76 4.95,30.82 ; M23.3 6.1,31.97 4.95,30.82
B5: length 96.5
  Top Layer w0.254: ANLG_OUTPUT.5 8.97,43.57 37.35,43.57 37.95,42.97 37.95,31.75 37.07,30.87 26.09,30.87 24.38,29.17 v1(24.38,25.87) M9.3
  Bottom Layer w0.254: 23.57,26.68 22.86,27.39 22.86,29.93 24.77,31.84 M25.3 ; 23.57,26.68 23.53,26.68 M29.3 ; 23.57,26.68 v1(24.38,25.87) 25.65,25.87 25.96,25.56 ; M31.3 26.01,25.62 25.96,25.56 ; M35.3 31.73,19.79 25.96,25.56
B6: length 88
  Top Layer w0.254: M11.3 v1(43.25,25.87) 39.02,30.1 39.02,46.16 36.17,49.01 8.66,49.01 ANLG_OUTPUT.6
  Bottom Layer w0.254: 50.91,25.87 v1(43.25,25.87) 42.24,26.88 ; 50.91,25.87 M45.3 ; 50.91,25.87 M37.3 ; 42.24,26.88 42.15,26.88 M32.3 ; 42.24,26.88 42.24,30.77 44.07,32.6 M28.3
B7: length 120.1
  Top Layer w0.254: v1(6.25,13.55) M13.3
  Bottom Layer w0.254: 4.19,17.36 5.84,19.01 M33.3 ; 4.19,17.36 4.19,14.31 4.95,13.55 v1(6.25,13.55) 7.14,12.66 M40.3 ; 4.19,17.36 0.66,20.89 0.66,48.12 1.4,48.86 8,48.86 8.64,48.22 8.64,46.44 ANLG_OUTPUT.7 11.3,43.78 57.02,43.78 57.9,42.9 M44.3
B8: length 102.1
  Top Layer w0.254: M15.3 25.8,13.55 v1(24.37,13.55) 24.37,15.95 25.91,17.49 37.72,17.49 38.3,18.07 38.3,43.12 37.49,43.93 11.91,43.93 11.18,44.67 11.18,46.57 10.03,47.71 ANLG_OUTPUT.8
  Bottom Layer w0.254: M42.3 24.88,13.04 v1(24.37,13.55) ; v1(24.37,13.55) 23.5,13.55 22.61,14.44 22.61,16.85 24.51,18.76 M36.3 ; v1(24.37,13.55) 23.48,12.66 M39.3
B9: length 72.5
  Top Layer w0.254: ANLG_OUTPUT.9 13.33,44.29 37.64,44.29 38.66,43.27 38.66,18.07 v1(43.31,13.42) 44.59,13.42 M17.3
  Bottom Layer w0.254: M38.3 44.45,19.9 42.29,17.74 42.29,14.44 ; M41.3 41.64,13.79 42.29,14.44 ; 42.29,14.44 v1(43.31,13.42)
G1: length 87.2
  Top Layer w0.152: SR1.15 68.2,33.24 v1(68.07,33.36) ; v1(4.57,35.27) R2.1
  Inner1 w0.152: v1(68.07,33.36) 68.07,34.12 71.37,37.43 71.37,41.87 69.6,43.65 8.38,43.65 4.57,39.84 v1(4.57,35.27)
G3: length 57.2
  Top Layer w0.152: v1(69.98,40.09) 69.47,39.59 SR1.1 ; v1(24.13,33.62) 24.68,34.17 R4.1
  Inner1 w0.152: v1(24.13,33.62) 24.13,37.55 29.97,43.4 66.68,43.4 v1(69.98,40.09)
G5: length 37.8
  Top Layer w0.152: SR1.2 68.2,39.59 v1(68.71,40.09) ; v1(42.93,33.49) 42.93,34.97 R6.1
  Inner1 w0.152: v1(42.93,33.49) 42.93,37.94 48.12,43.14 66.57,43.14 68.71,41 v1(68.71,40.09)
G7: length 92.6
  Top Layer w0.152: v1(4.83,21.93) 5.38,21.93 R8.1 ; v1(66.93,41.24) SR1.3
  Inner1 w0.152: v1(4.83,21.93) 5.84,22.95 5.84,25.51 5.11,26.24 5.11,32.88 8.89,36.66 22.86,36.66 23.88,35.65 23.88,34.12 23.5,33.74 23.5,33.21 23.62,33.08 24.61,33.08 28.19,36.66 41.91,36.66 42.39,36.18 42.39,33.26 42.8,32.85 43.46,32.85 53.49,42.89 65.28,42.89 v1(66.93,41.24)
G9: length 107.6
  Top Layer w0.152: R10.1 24.64,22.65 v1(24.64,20.28) ; v1(65.66,40.47) SR1.4
  Inner1 w0.152: v1(65.66,40.47) 63.5,42.63 53.59,42.63 43.56,32.6 42.69,32.6 42.14,33.16 42.14,36.07 41.79,36.41 28.29,36.41 24.71,32.83 23.52,32.83 23.24,33.11 23.24,33.87 23.62,34.25 23.62,35.52 22.73,36.41 9.02,36.41 ; v1(24.64,20.28) 11.43,20.28 5.36,26.35 5.36,32.76 9.02,36.41
G11: length 123.9
  Top Layer w0.152: SR1.5 64.38,38.59 v1(64.38,40.47) ; R12.1 43.22,20.32 v1(43.19,20.28)
  Inner1 w0.152: v1(64.38,40.47) 62.47,42.38 53.72,42.38 43.69,32.35 42.59,32.35 41.88,33.05 41.88,35.94 41.67,36.16 28.4,36.16 24.82,32.57 23.41,32.57 22.99,33 22.99,33.99 23.37,34.37 23.37,35.42 22.63,36.16 9.14,36.16 5.62,32.63 5.62,26.6 11.41,20.81 42.66,20.81 v1(43.19,20.28)
G13: length 126.4
  Top Layer w0.152: SR1.6 63.12,40.47 v1(63.11,40.47) ; v1(4.57,10.38) R14.1
  Inner1 w0.152: v1(63.11,40.47) 67.54,36.05 67.54,33.14 67.85,32.83 68.29,32.83 68.61,33.14 68.61,34.3 71.63,37.32 71.63,41.98 69.7,43.9 8.28,43.9 4.32,39.95 4.32,35.77 1.14,32.59 1.14,13.8 v1(4.57,10.38)
G15: length 161.4
  Top Layer w0.152: v1(26.03,12.23) 24.56,10.75 R16.1 ; v1(61.85,40.47) 61.85,38.58
  Inner1 w0.152: v1(26.03,12.23) 22.41,8.6 4.06,8.6 3.78,8.88 3.78,10.8 0.89,13.69 0.89,32.7 4.06,35.87 4.06,44.41 3.75,44.73 3.75,45.62 4.38,46.25 70.8,46.25 71.31,45.75 71.31,42.66 71.88,42.08 71.88,37.22 68.86,34.19 68.86,33.04 68.4,32.58 67.75,32.58 63.44,36.88 63.44,38.88 v1(61.85,40.47)
G17: length 62.9
  Top Layer w0.152: R18.1 44.83,11.98 v1(44.83,12.03)
  Inner1 w0.152: v1(44.83,12.03) 49.78,7.07 71.37,7.07 74.04,9.74 74.04,29.3 v1(69.6,33.74)
  Bottom Layer w0.152: v1(69.6,33.74) 68.33,35.01 SR2.15
G19: length 57.1
  Inner1 w0.152: v1(22.73,35.21) 22.73,32.89 23.31,32.32 41.15,32.32 42.77,30.7 65.62,30.7 67.76,28.55 67.76,26.41 68.07,26.1 68.52,26.1 68.83,26.41 68.83,26.91 v1(69.06,27.14)
  Bottom Layer w0.152: SR2.1 69.6,27.68 v1(69.06,27.14) ; R20.1 24.54,35.21 v1(22.73,35.21)
G21: length 36.7
  Inner1 w0.152: v1(40.64,33.19) 42.88,30.95 65.72,30.95 68.3,28.38 v1(68.3,26.63)
  Bottom Layer w0.152: v1(40.64,33.19) 40.93,33.19 R22.1 ; v1(68.3,26.63) 68.33,26.66 SR2.2
G23: length 61.1
  Inner1 w0.152: v1(13.72,28.65) 15.5,30.44 35.87,30.44 36.61,29.7 39.99,29.7 40.73,30.44 65.51,30.44 67.03,28.93 v1(67.03,26.63)
  Bottom Layer w0.152: v1(67.03,26.63) 67.06,26.66 SR2.3 ; v1(13.72,28.65) 15.18,28.65 R24.1
G25: length 44
  Inner1 w0.152: v1(66.29,25.74) 66.29,29.3 65.41,30.19 40.83,30.19 40.09,29.45 32.41,29.45 v1(31.5,28.54)
  Bottom Layer w0.152: v1(66.29,25.74) 65.79,26.25 SR2.4 ; v1(31.5,28.54) 32.97,28.54
G27: length 19.6
  Inner1 w0.152: v1(50.8,29.3) 51.43,29.93 61.72,29.93 v1(65.02,26.63)
  Bottom Layer w0.152: SR2.5 64.52,27.14 v1(65.02,26.63) ; v1(50.8,29.3) 52.28,29.3
G29: length 50.1
  Inner1 w0.152: v1(22.22,22.18) 28.05,28 50.26,28 51.93,29.68 61.62,29.68 63.75,27.54 v1(63.75,26.63)
  Bottom Layer w0.152: v1(63.75,26.63) 63.25,27.14 SR2.6 ; R30.1 23.7,22.18 v1(22.22,22.18)
G31: length 30.6
  Inner1 w0.152: v1(40.77,22.34) 46.18,27.75 50.36,27.75 52.04,29.42 61.5,29.42 62.48,28.44 v1(62.48,26.63)
  Bottom Layer w0.152: R31.1 42.22,22.34 v1(40.77,22.34) ; SR2.7 61.98,27.14 v1(62.48,26.63)
G33: length 61.7
  Inner1 w0.152: v1(12.95,16.83) 16.15,20.03 24.14,20.03 24.42,19.75 24.86,19.75 25.17,20.06 25.17,20.31 25.4,20.54 42.16,20.54 43.21,19.49 67.79,19.49 v1(68.2,19.9)
  Bottom Layer w0.152: v1(68.2,19.9) 68.45,19.65 SR3.15 ; v1(12.95,16.83) 14.08,15.71 R34.1
G35: length 46.7
  Inner1 w0.152: v1(31.62,15.93) 33.44,17.75 61.14,17.75 69.77,9.12 v1(69.77,8.72)
  Bottom Layer w0.152: v1(31.62,15.93) 32.63,15.93 R36.1 ; v1(69.77,8.72) 69.77,10.82 SR3.1
G37: length 25.3
  Inner1 w0.152: v1(50.8,16.6) 61.93,16.6 68.45,10.08 v1(68.45,8.72)
  Bottom Layer w0.152: v1(68.45,8.72) SR3.2 ; v1(50.8,16.6) 52.28,16.6
G39: length 53.7
  Inner1 w0.152: v1(67.18,8.72) 67.18,10.99 64.22,13.96 26.94,13.96 v1(22.48,9.5)
  Bottom Layer w0.152: v1(22.48,9.5) 23.95,9.5 R40.1 ; v1(67.18,8.72) SR3.3
G41: length 33.4
  Inner1 w0.152: v1(65.9,8.72) 65.9,11.91 64.11,13.7 45.62,13.7 v1(41.66,9.74)
  Bottom Layer w0.152: v1(65.9,8.72) 65.91,8.73 65.91,10.87 ; v1(41.66,9.74) 43.13,9.74
G43: length 58.3
  Inner1 w0.152: v1(64.63,8.72) 64.12,8.72 63.59,9.26 63.14,9.26 62.83,8.95 62.83,8.5 63.15,8.19 63.4,8.19 64.26,7.33 71.27,7.33 73.79,9.85 73.79,29.04 70.8,32.03 66.36,32.03 65.15,33.24 65.15,33.7 59.78,39.08 v1(57.78,39.08)
  Bottom Layer w0.152: R48.1 58.5,39.08 v1(57.78,39.08) ; v1(64.63,8.72) 64.64,8.73 SR3.5
G45: length 37.4
  Inner1 w0.152: v1(63.37,8.72) 64.51,7.58 71.12,7.58 72.34,8.8 72.34,17.16 65.53,23.96 v1(59.94,23.96)
  Bottom Layer w0.152: SR3.6 63.37,8.73 v1(63.37,8.72) ; v1(59.94,23.96) 61.04,22.87 R50.1
LCLK: length 105.6
  Top Layer w0.152: v1(64.64,20.03) 64.39,20.28 SR1.12 64.39,33.52 v1(64.48,33.62)
  Bottom Layer w0.152: v1(64.64,20.03) 64.64,18.01 SR3.12 64.64,15.18 62.38,12.92 60.35,12.92 59.31,11.88 59.31,4.49 55.54,0.72 6.71,0.72 5.9,1.53 5.9,3.71 SR_OUTPUT.4 ; v1(64.48,33.62) 64.52,33.65 SR2.12 64.52,37.15 70.23,42.87 70.23,45.17
MR: length 98.1
  Top Layer w0.152: v1(61.96,33.62) 61.85,33.5 61.85,22 v1(62.52,21.33)
  Bottom Layer w0.152: v1(62.52,21.33) 62.1,20.92 SR3.10 62.1,15.39 58.8,12.09 58.8,4.7 57.75,3.64 8.38,3.64 7.37,4.66 SR_OUTPUT.6 ; SR_INPUT.6 67.69,41.08 64.29,37.68 62.61,37.68 62.1,37.17 62.1,35.91 SR2.10 61.98,33.63 v1(61.96,33.62)
N1: length 91.1
  Top Layer w0.254: v1(39.96,42.63) 40.46,42.13 57.02,42.13 59.18,39.97 59.18,23.84 72.77,10.25 ANLG_INPUT.1 ; v1(36.96,42.63) 25.78,42.63 21.84,38.7 11.83,38.7 M2.3
  Bottom Layer w0.254: v1(39.96,42.63) v1(36.96,42.63)
N2: length 74.8
  Top Layer w0.254: M4.3 29.73,38.57 33.27,38.57 v1(35.31,40.6) ; ANLG_INPUT.2 71.64,3.38 71.64,10.87 58.83,23.69 58.83,39.81 56.87,41.77 v1(39.96,41.77)
  Bottom Layer w0.254: v1(39.96,41.77) 36.48,41.77 v1(35.31,40.6)
N3: length 48.4
  Top Layer w0.254: ANLG_INPUT.3 70.49,5.04 70.49,11.52 58.47,23.53 58.47,37.25 57.02,38.7 48.4,38.7 M6.3
N4: length 81.6
  Top Layer w0.254: ANLG_INPUT.4 70.23,3.19 69.1,4.32 69.1,12.4 58.11,23.39 58.11,28.58 55.95,30.75 40.58,30.75 v1(39.88,31.46) ; v1(36.83,31.46) 20.07,31.46 14.73,26.12 M8.3
  Bottom Layer w0.254: v1(39.88,31.46) v1(36.83,31.46)
N5: length 58.6
  Top Layer w0.254: v1(36.83,30.23) 32.47,25.87 M10.3 ; v1(39.93,30.4) 55.8,30.4 57.76,28.44 57.76,23.24 67.82,13.18 67.82,4.91 ANLG_INPUT.5
  Bottom Layer w0.254: v1(39.93,30.4) 36.99,30.4 v1(36.83,30.23)
N6: length 35.3
  Top Layer w0.254: ANLG_INPUT.6 66.55,3.39 66.55,13.95 54.62,25.87 M12.3
N7: length 67.4
  Top Layer w0.254: v1(39.5,18.5) 40.2,17.8 62.19,17.8 65.28,14.71 65.28,4.91 ANLG_INPUT.7 ; M14.3 11.57,13.68 15.24,13.68 20.07,18.5 v1(37.72,18.5)
  Bottom Layer w0.254: v1(39.5,18.5) v1(37.72,18.5)
N8: length 50.3
  Top Layer w0.254: v1(38.35,17.22) 34.82,13.68 M16.3 ; v1(40.64,17.22) 40.66,17.23 62.23,17.23 64.02,15.44 64.02,4.32 65.15,3.19 ANLG_INPUT.8
  Bottom Layer w0.254: v1(40.64,17.22) v1(38.35,17.22)
N9: length 20.9
  Top Layer w0.254: ANLG_INPUT.9 62.61,9.99 59.06,13.55 M18.3
OE: length 107.3
  Top Layer w0.152: v1(65.79,33.62) 65.79,31.58 SR1.13 65.66,20.3 v1(65.93,20.03)
  Bottom Layer w0.152: 70.23,47.71 71.5,46.44 71.5,43.78 65.79,38.06 SR2.13 v1(65.79,33.62) ; v1(65.93,20.03) 65.93,18.02 65.91,18.01 65.91,16.09 62.48,12.66 60.45,12.66 59.56,11.77 59.56,4.38 55.65,0.47 6.6,0.47 SR_OUTPUT.3
SCLK: length 103.4
  Top Layer w0.152: v1(63.19,33.62) 63.12,33.55 SR1.11 63.12,20.73 v1(63.41,20.44)
  Bottom Layer w0.152: v1(63.41,20.44) 63.41,18.04 SR3.11 63.37,14.27 62.27,13.17 60.24,13.17 59.05,11.98 59.06,4.59 55.47,1.01 8.61,1.01 SR_OUTPUT.5 ; v1(63.19,33.62) 63.25,33.67 SR2.11 63.25,37.05 63.63,37.43 64.43,37.43 68.98,41.98 68.98,46.42 SR_INPUT.5
$1N32987: length 11
  Top Layer w0.152: SR1.9 v1(60.58,33.62)
  Bottom Layer w0.152: v1(60.58,33.62) 61.09,33.11 61.72,33.11 61.74,33.08 66.01,33.08 66.03,33.11 66.17,33.11 67.06,34 SR2.14
$1N32993: length 21.2
  Bottom Layer w0.254: SR3.14 67.18,19.77 59.82,27.14 59.82,34.9 SR2.9
$1N34192: length 16.1
  Top Layer w0.152: SR_INPUT.2 72.77,38.95 66.93,33.11 SR1.14
$1N34221: length 72
  Bottom Layer w0.152: SR3.9 60.83,14.48 58.55,12.19 58.55,4.8 57.65,3.91 12.31,3.91 10.35,5.87 3.36,5.87 SR_OUTPUT.2
$1N43712: length 9.6
  Top Layer w0.152: M1.1 11.58,37.62 ; 11.58,37.62 11.12,37.16 ; 11.58,37.62 M2.1 ; 11.12,37.16 R2.2 ; 11.12,37.16 12.11,36.17 R1.1
$1N43716: length 3.9
  Top Layer w0.254: M1.2 M2.2
$1N43718: length 9.2
  Top Layer w0.152: 29.87,37.49 M4.1 ; 29.87,37.49 M3.1 ; 29.87,37.49 29.44,37.07 ; 29.44,37.07 30.27,36.24 R3.1 ; 29.44,37.07 R4.2
$1N43720: length 9.3
  Top Layer w0.152: 47.98,37.06 48.57,37.65 ; 47.98,37.06 48.94,36.1 R5.1 ; 47.98,37.06 46.18,35.27 ; 48.57,37.65 50.24,37.65 M6.1 ; 48.57,37.65 M5.1
$1N43729: length 9.1
  Top Layer w0.152: 47.97,24.48 48.41,24.92 ; 47.97,24.48 48.94,23.51 R11.1 ; 47.97,24.48 46.18,22.69 ; 48.41,24.92 M11.1 ; 48.41,24.92 M12.1
$1N43733: length 9.1
  Top Layer w0.152: R9.1 30.27,23.63 29.43,24.48 ; M9.1 29.87,24.92 ; 29.87,24.92 29.43,24.48 ; 29.87,24.92 M10.1 ; R10.2 29.43,24.48
$1N43737: length 9.2
  Top Layer w0.152: M7.1 11.58,25.17 ; 11.58,25.17 11.09,24.69 ; 11.58,25.17 M8.1 ; R8.2 11.09,24.69 ; 11.09,24.69 11.98,23.79 R7.1
$1N43739: length 9
  Top Layer w0.152: M13.1 11.58,12.6 ; 11.58,12.6 M14.1 ; 11.58,12.6 11.14,12.16 ; 11.14,12.16 12.11,11.19 R13.1 ; 11.14,12.16 R14.2
$1N43741: length 9
  Top Layer w0.152: R16.2 29.32,12.31 ; 29.32,12.31 30.27,11.35 R15.1 ; 29.32,12.31 29.74,12.73 ; 29.74,12.73 M16.1 ; 29.74,12.73 M15.1
$1N43743: length 8.7
  Top Layer w0.152: R18.2 47.96,12.15 ; 47.96,12.15 48.94,11.17 R17.1 ; 47.96,12.15 48.41,12.6 ; 48.41,12.6 M18.1 ; 48.41,12.6 M17.1
$1N43747: length 3.9
  Top Layer w0.254: M3.2 M4.2
$1N43751: length 3.7
  Top Layer w0.254: M6.2 50.24,39.55 M5.2
$1N43756: length 3.7
  Top Layer w0.254: M7.2 M8.2
$1N43761: length 3.8
  Top Layer w0.254: M9.2 M10.2
$1N43766: length 3.8
  Top Layer w0.254: M11.2 M12.2
$1N43771: length 3.7
  Top Layer w0.254: M13.2 M14.2
$1N43776: length 3.7
  Top Layer w0.254: M15.2 M16.2
$1N43781: length 3.7
  Top Layer w0.254: M17.2 M18.2
$1N44525: length 8.9
  Bottom Layer w0.152: 18.52,24.41 M30.1 ; 18.52,24.41 18.9,24.04 ; 18.52,24.41 M29.1 ; R30.2 18.9,24.04 ; 18.9,24.04 18.24,23.38 18.24,22.19
$1N44529: length 3.7
  Bottom Layer w0.254: M29.2 M30.2
$1N44667: length 9.2
  Bottom Layer w0.152: 27.39,28.54 27.39,29.79 28.08,30.48 ; 28.08,30.48 27.66,30.89 ; 28.08,30.48 R26.2 ; M26.1 27.66,30.89 ; 27.66,30.89 M25.1
$1N44669: length 3.7
  Bottom Layer w0.254: M26.2 M25.2
$1N44737: length 9.5
  Bottom Layer w0.152: R32.1 36.66,23.45 37.4,24.2 ; 37.4,24.2 36.94,24.67 ; 37.4,24.2 R31.2 ; 36.94,24.67 M32.1 ; 36.94,24.67 M31.1
$1N44739: length 3.9
  Bottom Layer w0.254: M32.2 M31.2
$1N44807: length 9.3
  Bottom Layer w0.152: 28.2,17.4 27.79,17.81 ; 28.2,17.4 R36.2 ; 28.2,17.4 27.26,16.46 R35.1 ; 27.79,17.81 M35.1 ; 27.79,17.81 M36.1
$1N44809: length 3.7
  Bottom Layer w0.254: M35.2 M36.2
$1N45023: length 9.2
  Bottom Layer w0.152: 38.18,37.14 37.83,37.49 ; 38.18,37.14 37.29,36.24 R21.1 ; 38.18,37.14 R22.2 ; 37.83,37.49 M21.1 ; 37.83,37.49 M22.1
$1N45025: length 3.8
  Bottom Layer w0.254: M22.2 M21.2
$1N45166: length 9.1
  Bottom Layer w0.152: 19.87,37.04 19.41,37.49 ; 19.87,37.04 18.88,36.05 R19.1 ; 19.87,37.04 R20.2 ; 19.41,37.49 M19.1 ; 19.41,37.49 M20.1
$1N45168: length 3.8
  Bottom Layer w0.254: M20.2 M19.2
$1N45236: length 9.6
  Bottom Layer w0.152: R23.1 9.48,29.84 10.27,30.63 ; 10.27,30.63 R24.2 ; 10.27,30.63 9.89,31.02 ; 9.89,31.02 M23.1 ; 9.89,31.02 M24.1
$1N45238: length 3.9
  Bottom Layer w0.254: M24.2 M23.2
$1N45306: length 9.3
  Bottom Layer w0.152: 9.48,17.7 8.84,17.07 R33.1 ; 9.48,17.7 R34.2 ; 9.48,17.7 9.12,18.06 ; M34.1 9.12,18.06 ; 9.12,18.06 M33.1
$1N45308: length 3.7
  Bottom Layer w0.254: M34.2 M33.2
$1N45376: length 9.1
  Bottom Layer w0.152: R39.1 18.37,10.79 19.04,11.45 ; 19.04,11.45 18.78,11.71 ; 19.04,11.45 R40.2 ; 18.78,11.71 M39.1 ; 18.78,11.71 M40.1
$1N45378: length 3.7
  Bottom Layer w0.254: M39.2 M40.2
$1N45446: length 9.4
  Bottom Layer w0.152: M41.1 37.83,12.09 ; 37.83,12.09 M42.1 ; 37.83,12.09 38.2,11.72 ; 38.2,11.72 37.29,10.81 R41.1 ; 38.2,11.72 R42.2
$1N45448: length 3.7
  Bottom Layer w0.254: 39.64,13.99 35.96,13.99
$1N45516: length 9.7
  Bottom Layer w0.152: 47.4,18.52 46.56,17.68 R37.1 ; 47.4,18.52 47.03,18.88 46.48,18.88 ; 47.4,18.52 R38.2 ; 48.91,18.95 45.23,18.95
$1N45518: length 3.7
  Bottom Layer w0.254: M37.2 M38.2
$1N45586: length 9.5
  Bottom Layer w0.152: 47.33,31.29 46.44,30.4 R28.1 ; 47.33,31.29 46.97,31.65 ; 47.33,31.29 R27.2 ; M27.1 46.97,31.65 ; 46.97,31.65 M28.1
$1N45588: length 3.8
  Bottom Layer w0.254: M27.2 M28.2
$1N47159: length 9.1
  Bottom Layer w0.152: R48.2 54.17,40.45 ; 54.17,40.45 53.83,40.79 ; 54.17,40.45 53.42,39.7 R47.1 ; 53.83,40.79 M44.1 ; 53.83,40.79 M43.1
$1N47164: length 3.8
  Bottom Layer w0.254: M44.2 M43.2
$1N47285: length 9.4
  Bottom Layer w0.152: 56.19,24.59 55.86,24.92 ; 56.19,24.59 R50.2 ; 56.19,24.59 55.2,23.61 R49.1 ; 55.86,24.92 M45.1 ; 55.86,24.92 M46.1
$1N47290: length 3.9
  Bottom Layer w0.254: M46.2 M45.2

## Copper pours and planes (outline as drawn; the poured copper is in the pictures)
GND on Top Layer: 0,50 75.06,50 75.06,-0.04 0,-0.04
GND on Bottom Layer: 0,50 75.06,50 75.06,-0.04 0,-0.04
GND on Inner1: 0,50 75.06,50 75.06,-0.04 0,-0.04
GND on Inner2: 0,50 75.06,50 75.06,-0.04 0,-0.04

## Text on the board
Bottom Silkscreen Layer: ANLG_OUTPUT | SR_INPUT | ANLG_INPUT | SR_OUTPUT
Top Silkscreen Layer: Logic Voltage: 5V | PCB Stack: 4 layers (Comp-Sign-Sign-Comp) | Revision: Rev 2.0 - Dec 2025 | Analog Range: 0-3.3V | SSRC v2.0 | Nodes: N1-N9 (Input), B1-B9 (Output) | Control: Serial Chain (SN74HC595) | Patent Pending | Designed by Prayag C. | Solid-State Reconfigurable Circuit
